# Altium project FE.PrjPcb
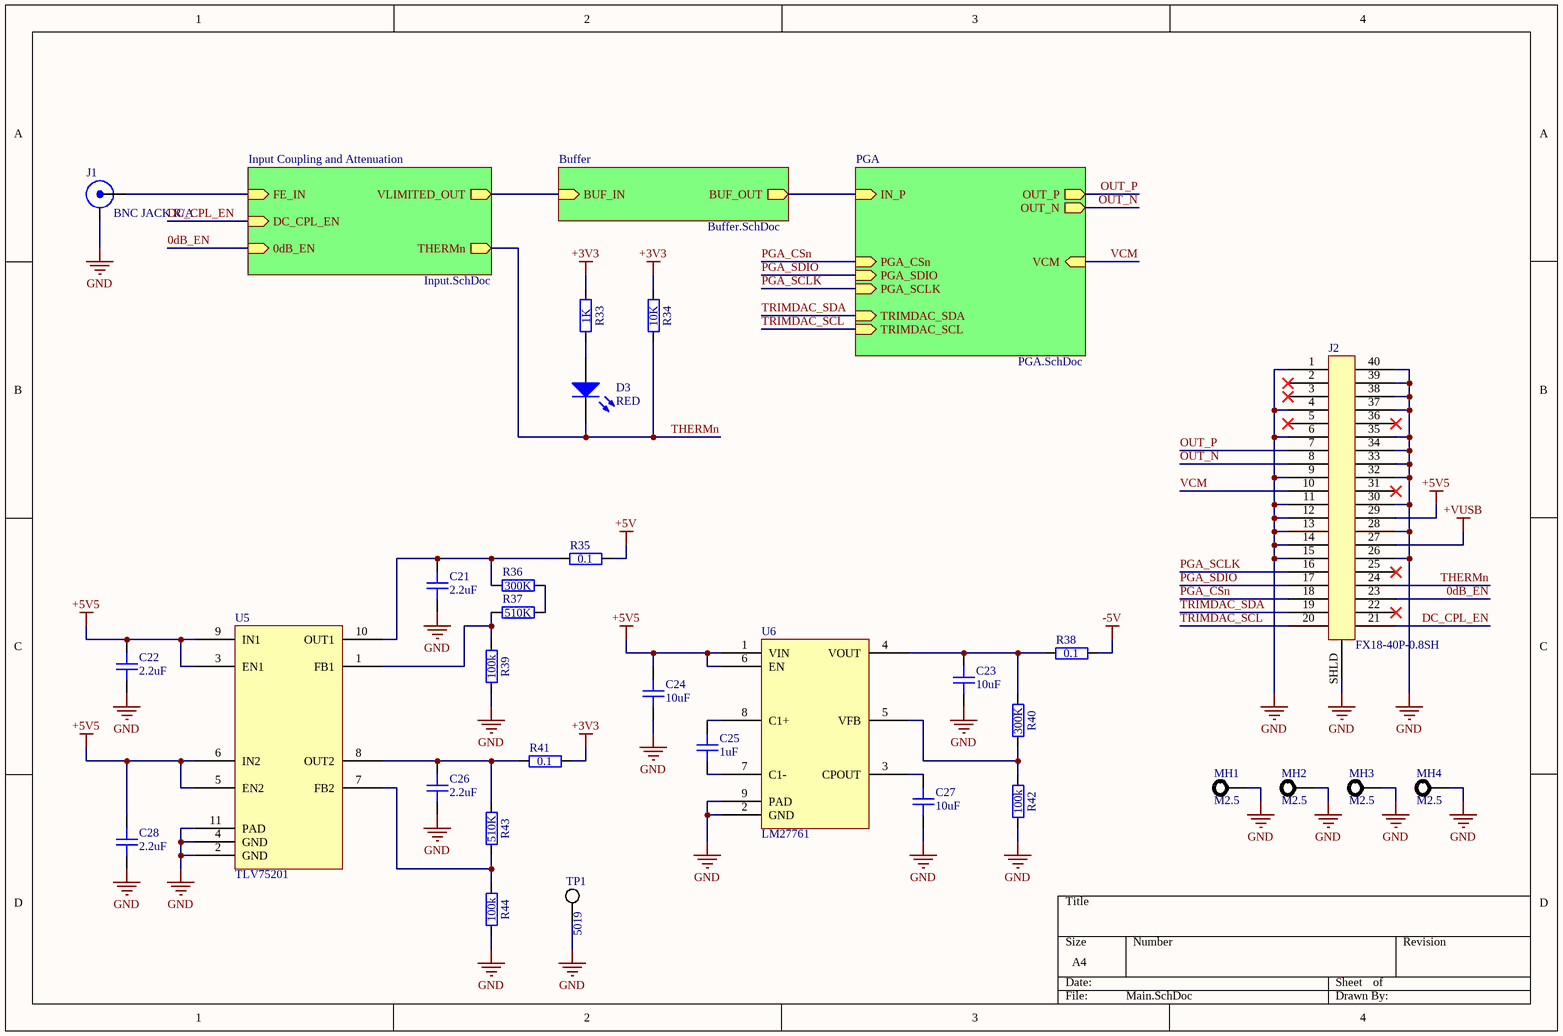
[diagram p0: Main.SchDoc]
4 sheets, 122 parts. Net scope: hierarchical (ports join the sheet entries above them; power ports are global).
Board file: FE.PcbDoc
Sheets:
  Main.SchDoc
    Input Coupling and Attenuation = Input.SchDoc
    Buffer = Buffer.SchDoc
    PGA = PGA.SchDoc

## Sheet Main.SchDoc
size A4

### Parts
C21  value 2.2uF  [GEN_C_0402]  (hidden comment: CAP 2.2uF 10V X5R 0402)
C22  value 2.2uF  [GEN_C_0402]  (hidden comment: CAP 2.2uF 10V X5R 0402)
C23  value 10uF  [GEN_C_0603]  (hidden comment: CAP 10uF 10V X5R 0603)
C24  value 10uF  [GEN_C_0603]  (hidden comment: CAP 10uF 10V X5R 0603)
C25  value 1uF  [GEN_C_0402]  (hidden comment: CAP 1uF 25V X5R 0402)
C26  value 2.2uF  [GEN_C_0402]  (hidden comment: CAP 2.2uF 10V X5R 0402)
C27  value 10uF  [GEN_C_0603]  (hidden comment: CAP 10uF 10V X5R 0603)
C28  value 2.2uF  [GEN_C_0402]  (hidden comment: CAP 2.2uF 10V X5R 0402)
D3  RED  [LED_0603_APT1608]
J1  BNC JACK R/A  [MOL_0731000105]
J2  FX18-40P-0.8SH  [HIR_FX18-40P-0.8SH]
MH1  M2.5  [MH M2.5]  (no BOM)
MH2  M2.5  [MH M2.5]  (no BOM)
MH3  M2.5  [MH M2.5]  (no BOM)
MH4  M2.5  [MH M2.5]  (no BOM)
R33  value 1K  [GEN_R_0402]  (hidden comment: RES 1K OHM 1% 1/10W 0402)
R34  value 10K  [GEN_R_0402]  (hidden comment: RES 10K OHM 1% 1/10W 0402)
R35  0.1  [GEN_R_0402]
R36  value 300K  [GEN_R_0402]  (hidden comment: RES 300K OHM 1% 1/10W 0402)
R37  value 510K  [GEN_R_0402]  (hidden comment: RES 510K OHM 1% 1/10W 0402)
R38  0.1  [GEN_R_0402]
R39  value 100k  [GEN_R_0402]  (hidden comment: RES 100K OHM 1% 1/10W 0402)
R40  value 300K  [GEN_R_0402]  (hidden comment: RES 300K OHM 1% 1/10W 0402)
R41  0.1  [GEN_R_0402]
R42  value 100k  [GEN_R_0402]  (hidden comment: RES 100K OHM 1% 1/10W 0402)
R43  value 510K  [GEN_R_0402]  (hidden comment: RES 510K OHM 1% 1/10W 0402)
R44  value 100k  [GEN_R_0402]  (hidden comment: RES 100K OHM 1% 1/10W 0402)
TP1  5019  [KEY_5019]
U5  TLV75201  [TI_WSON10_DSQ0010A]
U6  LM27761  [TI_WSON8_DSG0008A]

### Sub-sheets
Buffer = Buffer.SchDoc: BUF_IN (in), BUF_OUT (out)
Input Coupling and Attenuation = Input.SchDoc: 0dB_EN (in), FE_IN (in), VLIMITED_OUT (out), DC_CPL_EN (in), THERMn (out)
PGA = PGA.SchDoc: IN_P (in), OUT_N (out), PGA_SDIO (in), OUT_P (out), VCM (in), PGA_SCLK (in), PGA_CSn (in), TRIMDAC_SDA (in), TRIMDAC_SCL (in)

### Nets
+3V3: R33.1 R34.2 R41.2
+5V: R35.2
+5V5: C22.2 C24.2 C28.2 J2.29 U5.3(EN1) U5.5(EN2) U5.6(IN2) U5.9(IN1) U6.1(VIN) U6.6(EN)
+VUSB: J2.27
-5V: R38.2
GND: C21.1 C22.1 C23.1 C24.1 C26.1 C27.1 C28.1 J1.2(SHIELD) J2.1 J2.4 J2.6 J2.9 J2.11 J2.12 J2.13 J2.14 J2.15 J2.26 J2.28 J2.30 J2.32 J2.33 J2.34 J2.35 J2.37 J2.38 J2.39 J2.40 J2.SHLD MH1.1 MH2.1 MH3.1 MH4.1 R39.1 R42.1 R44.1 TP1.1 U5.2(GND) U5.4(GND) U5.11(PAD) U6.2(GND) U6.9(PAD)
0dB_EN: J2.23 ; sheet Input Coupling and Attenuation/0dB_EN
DC_CPL_EN: J2.21 ; sheet Input Coupling and Attenuation/DC_CPL_EN
OUT_N: J2.8 ; sheet PGA/OUT_N
OUT_P: J2.7 ; sheet PGA/OUT_P
PGA_CSn: J2.18 ; sheet PGA/PGA_CSn
PGA_SCLK: J2.16 ; sheet PGA/PGA_SCLK
PGA_SDIO: J2.17 ; sheet PGA/PGA_SDIO
THERMn: D3.1(K) J2.24 R34.1 ; sheet Input Coupling and Attenuation/THERMn
TRIMDAC_SCL: J2.20 ; sheet PGA/TRIMDAC_SCL
TRIMDAC_SDA: J2.19 ; sheet PGA/TRIMDAC_SDA
VCM: J2.10 ; sheet PGA/VCM
NetC1_2: sheet Input Coupling and Attenuation/VLIMITED_OUT, sheet Buffer/BUF_IN
NetC14_2: J1.1(Signal) ; sheet Input Coupling and Attenuation/FE_IN
NetC21_2: C21.2 R35.1 R36.2 U5.10(OUT1)
NetC23_2: C23.2 R38.1 R40.2 U6.4(VOUT)
NetC25_1: C25.1 U6.7(C1-)
NetC25_2: C25.2 U6.8(C1+)
NetC26_2: C26.2 R41.1 R43.2 U5.8(OUT2)
NetC27_2: C27.2 U6.3(CPOUT)
NetD3_2: D3.2(A) R33.2
NetQ1_2: sheet Buffer/BUF_OUT, sheet PGA/IN_P
NetR36_1: R36.1 R37.1
NetR37_2: R37.2 R39.2 U5.1(FB1)
NetR40_1: R40.1 R42.2 U6.5(VFB)
NetR43_1: R43.1 R44.2 U5.7(FB2)

Not connected (* = marked no-connect by the designer): J2 2* 3* 5* 22* 25* 31* 36*

### Library data of the parts
D3 = LED RED 0603 APT1608: Supplier 1: Digi-Key; Supplier Part Number 1: 754-1930-1-ND
J2 = CONN HDR FX18-40P-0.8SH: Supplier 1: Digi-Key; Supplier Part Number 1: H11868-ND
MH1-MH4 = MH M2.5
R33 = RES 1K OHM 1% 1/10W 0402: Power Rating: 0.1W; Tolerance: 1%; Package: 0402; Supplier 1: Digi-Key; Supplier Part Number 1: P1.00KLCT-ND
R34 = RES 10K OHM 1% 1/10W 0402: Power Rating: 0.1W; Tolerance: 1%; Package: 0402; Supplier 1: Digi-Key; Supplier Part Number 1: P10.0KLCT-ND
R35 R38 R41 = RES 0.1 OHM 1% 1/6W 0402: Tolerance: 1%; Power Rating: 0.16W; Package: 0402; Supplier 1: Digi-Key; Supplier Part Number 1: P.10AKCT-ND; Value: 0.1
R36 R40 = RES 300K OHM 1% 1/10W 0402: Power Rating: 0.1W; Tolerance: 1%; Package: 0402; Supplier 1: Digi-Key; Supplier Part Number 1: P300KLCT-ND
R37 R43 = RES 510K OHM 1% 1/10W 0402: Power Rating: 0.1W; Tolerance: 1%; Package: 0402; Supplier 1: Digi-Key; Supplier Part Number 1: P510KLCT-ND
R39 R42 R44 = RES 100K OHM 1% 1/10W 0402: Power Rating: 0.1W; Tolerance: 1%; Package: 0402; Supplier 1: Digi-Key; Supplier Part Number 1: P100KLCT-ND
TP1 = TP KEYSTONE 5019: Supplier 1: Digi-Key; Supplier Part Number 1: 36-5019CT-ND
U5 = IC LDO TLV75201: Supplier 1: Digi-Key; Supplier Part Number 1: 296-TLV75201PDSQRCT-ND
U6 = IC CPUMP LM27761: Supplier 1: Digi-Key; Supplier Part Number 1: 296-44379-1-ND
C21 C22 C26 C28 = CAP 2.2uF 10V X5R 0402: Package: 0402; Voltage Rating: 10V; Supplier 1: Digi-Key; Supplier Part Number 1: 587-3153-1-ND
C23 C24 C27 = CAP 10uF 10V X5R 0603: Package: 0402; Voltage Rating: 10V; Supplier 1: Digi-Key; Supplier Part Number 1: 490-10474-1-ND
C25 = CAP 1uF 25V X5R 0402: Package: 0402; Voltage Rating: 25V; Supplier 1: Digi-Key; Supplier Part Number 1: 490-10017-1-ND
J1 = BNC JACK R/A: Supplier 1: Digi-Key; Supplier Part Number 1: WM5524-ND

## Sheet Input.SchDoc
size A4
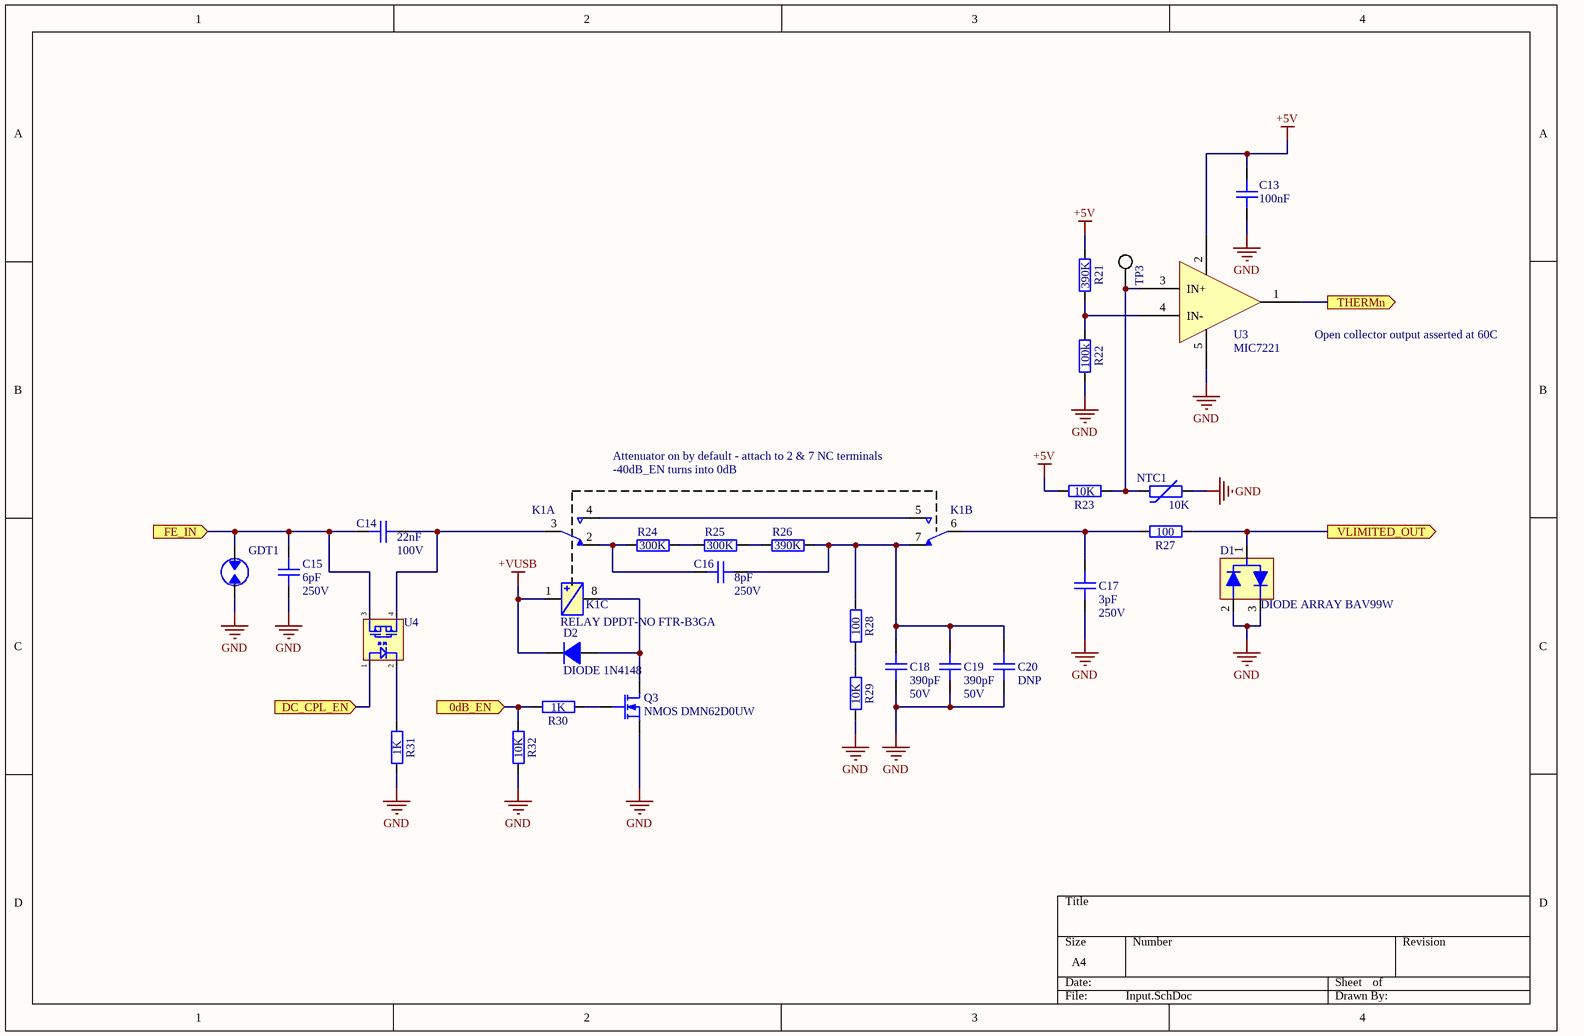
[diagram p1: Input.SchDoc]

### Parts
C13  value 100nF  [GEN_C_0402]  (hidden comment: CAP 100nF 16V X7R 0402)
C14  value 22nF  Voltage Rating: 100V  [GEN_C_0603]  (hidden comment: CAP 22nF 100V X7R 0603)
C15  value 6pF  Voltage Rating: 250V  [GEN_C_0603]  (hidden comment: CAP 6pF 250V C0G 0603)
C16  value 8pF  Voltage Rating: 250V  [GEN_C_0603]  (hidden comment: CAP 8pF 250V C0G 0603)
C17  value 3pF  Voltage Rating: 250V  [GEN_C_0603]  (hidden comment: CAP 3pF 250V C0G 0603)
C18  value 390pF  Voltage Rating: 50V  [GEN_C_0402]  (hidden comment: CAP 390pF 50V C0G 0402)
C19  value 390pF  Voltage Rating: 50V  [GEN_C_0402]  (hidden comment: CAP 390pF 50V C0G 0402)
C20  value DNP  [GEN_C_0402]  (hidden comment: CAP DNP 0402)
D1  DIODE ARRAY BAV99W  [GEN_SOT_323]
D2  DIODE 1N4148  [GEN_SOD_323]
GDT1  GDT 90V  [BOU_2051]  (value not drawn)
K1  RELAY DPDT-NO FTR-B3GA  [FUJ_FTR-B3GA]  (value not drawn)  (parts A,B,C of 3)
NTC1  value 10K  [GEN_R_0402]  (hidden comment: NTC 10K 3900K 0402)
Q3  NMOS DMN62D0UW  [GEN_SOT_323]
R21  value 390K  [GEN_R_0402]  (hidden comment: RES 390K OHM 1% 1/10W 0402)
R22  value 100k  [GEN_R_0402]  (hidden comment: RES 100K OHM 1% 1/10W 0402)
R23  value 10K  [GEN_R_0402]  (hidden comment: RES 10K OHM 1% 1/10W 0402)
R24  value 300K  [GEN_R_0402]  (hidden comment: RES 300K OHM 1% 1/10W 0402)
R25  value 300K  [GEN_R_0402]  (hidden comment: RES 300K OHM 1% 1/10W 0402)
R26  value 390K  [GEN_R_0402]  (hidden comment: RES 390K OHM 1% 1/10W 0402)
R27  value 100  [GEN_R_0402]  (hidden comment: RES 100 OHM 1% 1/10W 0402)
R28  value 100  [GEN_R_0402]  (hidden comment: RES 100 OHM 1% 1/10W 0402)
R29  value 10K  [GEN_R_0402]  (hidden comment: RES 10K OHM 1% 1/10W 0402)
R30  value 1K  [GEN_R_0402]  (hidden comment: RES 1K OHM 1% 1/10W 0402)
R31  value 1K  [GEN_R_0402]  (hidden comment: RES 1K OHM 1% 1/10W 0402)
R32  value 10K  [GEN_R_0402]  (hidden comment: RES 10K OHM 1% 1/10W 0402)
TP3  5019  [KEY_5019]  (value not drawn)
U3  MIC7221  [GEN_SOT23_5_950_2900X1600X1450]
U4  SSR CPC1017NTR  [IXY_CPC1017]  (value not drawn)

### Ports
0dB_EN (in), DC_CPL_EN (in), FE_IN (in), THERMn (out), VLIMITED_OUT (out)

### Nets
+5V: C13.1 R21.1 R23.2 U3.2(V+)
+VUSB: D2.1(K) K1.1
GND: C13.2 C15.1 C17.2 C18.1 C19.1 C20.1 D1.2 D1.3 GDT1.2 NTC1.2 Q3.3(S) R22.2 R29.1 R31.1 R32.1 U3.5(V-)
0dB_EN: R30.2 R32.2 ; port 0dB_EN
DC_CPL_EN: U4.1 ; port DC_CPL_EN
THERMn: U3.1(OUT) ; port THERMn
NetC1_2: D1.1 R27.1 ; port VLIMITED_OUT
NetC14_1: C14.1 K1.3 U4.4
NetC14_2: C14.2 C15.2 GDT1.1 U4.3 ; port FE_IN
NetC16_1: C16.1 C18.2 C19.2 C20.2 K1.7 R26.2 R28.2
NetC16_2: C16.2 K1.2 R24.1
NetC17_1: C17.1 K1.6 R27.2
NetD2_2: D2.2(A) K1.8 Q3.1(D)
NetK1_4: K1.4 K1.5
NetNTC1_1: NTC1.1 R23.1 TP3.1 U3.3(IN+)
NetQ3_2: Q3.2(G) R30.1
NetR21_2: R21.2 R22.1 U3.4(IN-)
NetR24_2: R24.2 R25.1
NetR25_2: R25.2 R26.1
NetR28_1: R28.1 R29.2
NetR31_2: R31.2 U4.2

### Notes on the sheet
- Open collector output asserted at 60C
- Attenuator on by default - attach to 2 & 7 NC terminals
- -40dB_EN turns into 0dB

### Library data of the parts
D2 = DIODE 1N4148: Max Reverse Voltage: 75V; Max Current: 150mA; Supplier 1: Digi-Key; Supplier Part Number 1: 1N4148WS-FDICT-ND
Q3 = NMOS DMN62D0UW: Vdss: 60V; Id: 340mA; Max Power: 320mW; Supplier 1: Digi-Key; Supplier Part Number 1: DMN62D0UW-7DICT-ND
R21 R26 = RES 390K OHM 1% 1/10W 0402: Power Rating: 0.1W; Tolerance: 1%; Package: 0402; Supplier 1: Digi-Key; Supplier Part Number 1: P390KLCT-ND
R22 = RES 100K OHM 1% 1/10W 0402: Power Rating: 0.1W; Tolerance: 1%; Package: 0402; Supplier 1: Digi-Key; Supplier Part Number 1: P100KLCT-ND
R23 R29 R32 = RES 10K OHM 1% 1/10W 0402: Power Rating: 0.1W; Tolerance: 1%; Package: 0402; Supplier 1: Digi-Key; Supplier Part Number 1: P10.0KLCT-ND
R24 R25 = RES 300K OHM 1% 1/10W 0402: Power Rating: 0.1W; Tolerance: 1%; Package: 0402; Supplier 1: Digi-Key; Supplier Part Number 1: P300KLCT-ND
R27 R28 = RES 100 OHM 1% 1/10W 0402: Power Rating: 0.1W; Tolerance: 1%; Package: 0402; Supplier 1: Digi-Key; Supplier Part Number 1: P100LCT-ND
R30 R31 = RES 1K OHM 1% 1/10W 0402: Power Rating: 0.1W; Tolerance: 1%; Package: 0402; Supplier 1: Digi-Key; Supplier Part Number 1: P1.00KLCT-ND
TP3 = TP KEYSTONE 5019: Supplier 1: Digi-Key; Supplier Part Number 1: 36-5019CT-ND
U3 = IC COMP MIC7221YM5: Supplier 1: Digi-Key; Supplier Part Number 1: 576-2901-1-ND
C13 = CAP 100nF 16V X7R 0402: Package: 0402; Voltage Rating: 16V; Supplier 1: Digi-Key; Supplier Part Number 1: 490-4759-1-ND
C14 = CAP 22nF 100V X7R 0603: Package: 0603; Supplier 1: Digi-Key; Supplier Part Number 1: 490-4782-1-ND
C15 = CAP 6pF 250V C0G 0603: Supplier 1: Digi-Key; Supplier Part Number 1: 399-8734-1-ND; Package: 0603
C16 = CAP 8pF 250V C0G 0603: Package: 0603; Supplier 1: Digi-Key; Supplier Part Number 1: 399-8740-1-ND
C17 = CAP 3pF 250V C0G 0603: Package: 0603; Supplier 1: Digi-Key; Supplier Part Number 1: 399-8820-1-ND
C18 C19 = CAP 390pF 50V C0G 0402: Package: 0402; Supplier 1: Digi-Key; Supplier Part Number 1: 490-8202-1-ND
C20 = CAP DNP 0402: Package: 0402
D1 = DIODE ARRAY BAV99W: Supplier 1: Digi-Key; Supplier Part Number 1: BAV99W-FDICT-ND
GDT1 = GDT 90V: Supplier 1: Digi-Key; Supplier Part Number 1: 2051-09-SM-RPLFCT-ND
NTC1 = NTC 10K 3900K 0402: Package: 0402; B Value: 3900k; Supplier 1: Digi-Key; Supplier Part Number 1: P12985CT-ND
U4 = SSR CPC1017NTR: Supplier 1: Digi-Key; Supplier Part Number 1: CLA233CT-ND

## Sheet Buffer.SchDoc
size A4
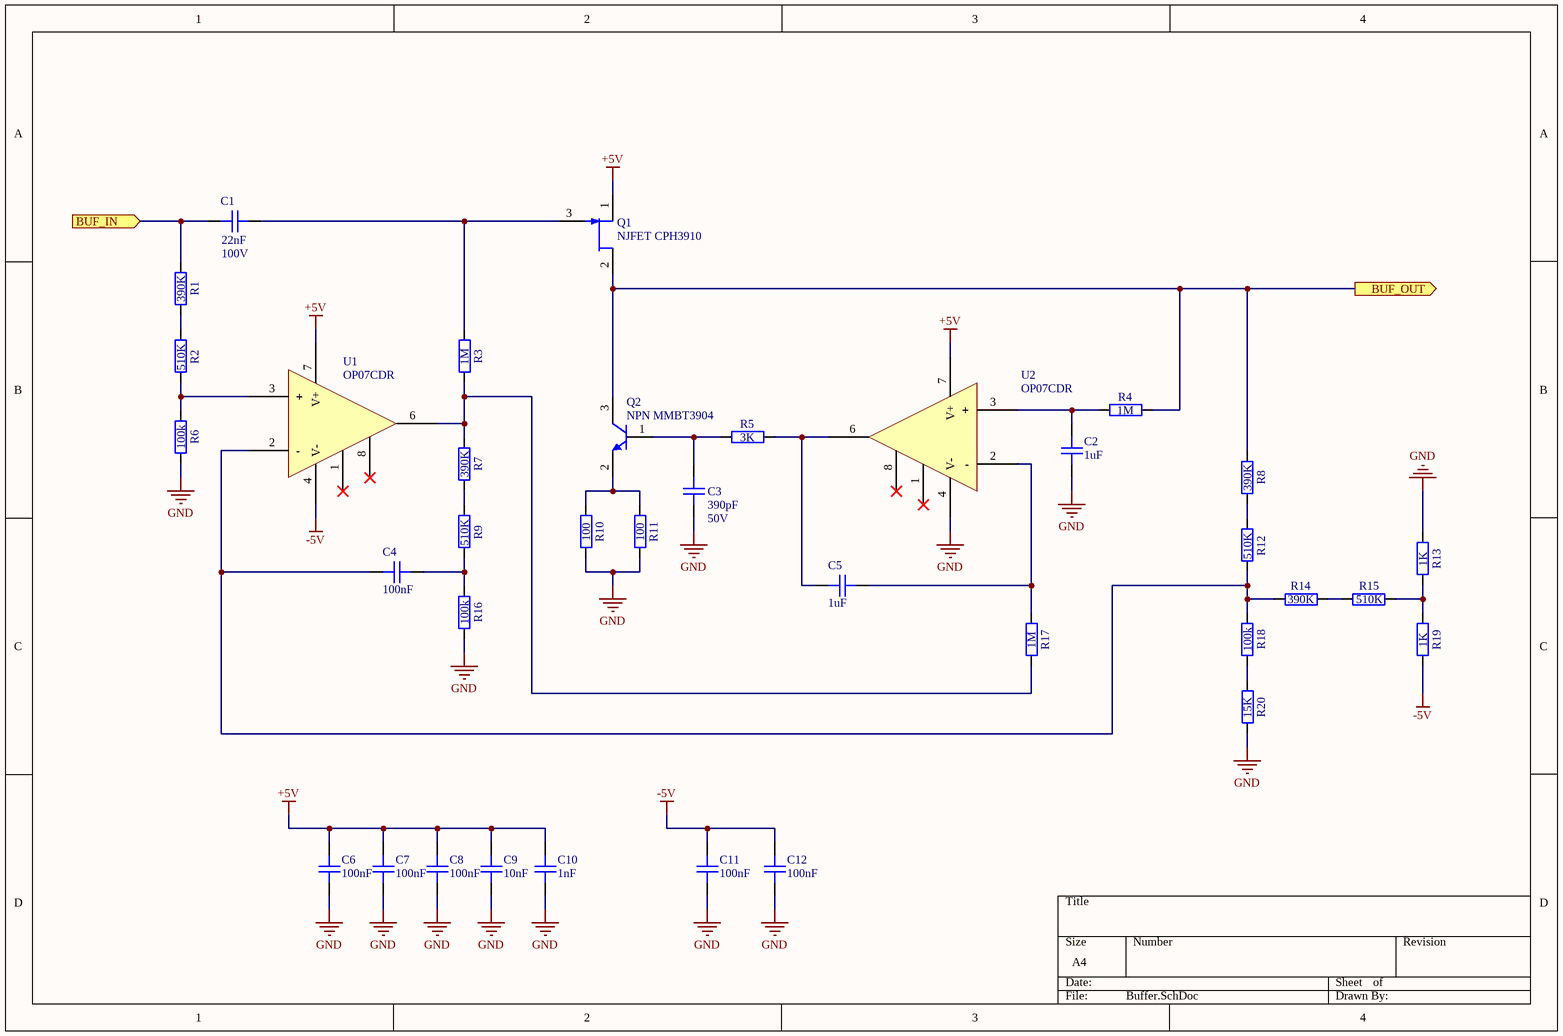
[diagram p2: Buffer.SchDoc]

### Parts
C1  value 22nF  Voltage Rating: 100V  [GEN_C_0603]  (hidden comment: CAP 22nF 100V X7R 0603)
C2  value 1uF  [GEN_C_0402]  (hidden comment: CAP 1uF 25V X5R 0402)
C3  value 390pF  Voltage Rating: 50V  [GEN_C_0402]  (hidden comment: CAP 390pF 50V C0G 0402)
C4  value 100nF  [GEN_C_0402]  (hidden comment: CAP 100nF 16V X7R 0402)
C5  value 1uF  [GEN_C_0402]  (hidden comment: CAP 1uF 25V X5R 0402)
C6  value 100nF  [GEN_C_0402]  (hidden comment: CAP 100nF 16V X7R 0402)
C7  value 100nF  [GEN_C_0402]  (hidden comment: CAP 100nF 16V X7R 0402)
C8  value 100nF  [GEN_C_0402]  (hidden comment: CAP 100nF 16V X7R 0402)
C9  value 10nF  [GEN_C_0402]  (hidden comment: CAP 10nF 50V X7R 0402)
C10  value 1nF  [GEN_C_0402]  (hidden comment: CAP 1nF 50V X7R 0402)
C11  value 100nF  [GEN_C_0402]  (hidden comment: CAP 100nF 16V X7R 0402)
C12  value 100nF  [GEN_C_0402]  (hidden comment: CAP 100nF 16V X7R 0402)
Q1  NJFET CPH3910  [ON_SOT23_CPH3]
Q2  NPN MMBT3904  [MMC_SOT23]
R1  value 390K  [GEN_R_0402]  (hidden comment: RES 390K OHM 1% 1/10W 0402)
R2  value 510K  [GEN_R_0402]  (hidden comment: RES 510K OHM 1% 1/10W 0402)
R3  value 1M  [GEN_R_0402]  (hidden comment: RES 1M OHM 1% 1/10W 0402)
R4  value 1M  [GEN_R_0402]  (hidden comment: RES 1M OHM 1% 1/10W 0402)
R5  value 3K  [GEN_R_0402]  (hidden comment: RES 3K OHM 1% 1/10W 0402)
R6  value 100k  [GEN_R_0402]  (hidden comment: RES 100K OHM 1% 1/10W 0402)
R7  value 390K  [GEN_R_0402]  (hidden comment: RES 390K OHM 1% 1/10W 0402)
R8  value 390K  [GEN_R_0402]  (hidden comment: RES 390K OHM 1% 1/10W 0402)
R9  value 510K  [GEN_R_0402]  (hidden comment: RES 510K OHM 1% 1/10W 0402)
R10  value 100  [GEN_R_0402]  (hidden comment: RES 100 OHM 1% 1/10W 0402)
R11  value 100  [GEN_R_0402]  (hidden comment: RES 100 OHM 1% 1/10W 0402)
R12  value 510K  [GEN_R_0402]  (hidden comment: RES 510K OHM 1% 1/10W 0402)
R13  value 1K  [GEN_R_0402]  (hidden comment: RES 1K OHM 1% 1/10W 0402)
R14  value 390K  [GEN_R_0402]  (hidden comment: RES 390K OHM 1% 1/10W 0402)
R15  value 510K  [GEN_R_0402]  (hidden comment: RES 510K OHM 1% 1/10W 0402)
R16  value 100k  [GEN_R_0402]  (hidden comment: RES 100K OHM 1% 1/10W 0402)
R17  value 1M  [GEN_R_0402]  (hidden comment: RES 1M OHM 1% 1/10W 0402)
R18  value 100k  [GEN_R_0402]  (hidden comment: RES 100K OHM 1% 1/10W 0402)
R19  value 1K  [GEN_R_0402]  (hidden comment: RES 1K OHM 1% 1/10W 0402)
R20  value 15K  [GEN_R_0402]  (hidden comment: RES 15K OHM 1% 1/10W 0402)
U1  OP07CDR  [TI_SOIC8_D0008A]
U2  OP07CDR  [TI_SOIC8_D0008A]

### Ports
BUF_IN (in), BUF_OUT (out)

### Nets
+5V: C6.1 C7.1 C8.1 C9.2 C10.2 Q1.1(S) U1.7(V+) U2.7(V+)
-5V: C11.1 C12.1 R19.2 U1.4(V-)
GND: C2.1 C3.1 C6.2 C7.2 C8.2 C9.1 C10.1 C11.2 C12.2 R6.2 R10.1 R11.1 R13.1 R16.2 R20.1 U2.4(V-)
NetC1_1: C1.1 Q1.3(G) R3.2
NetC1_2: C1.2 R1.1 ; port BUF_IN
NetC2_2: C2.2 R4.2 U2.3(+)
NetC3_2: C3.2 Q2.1(B) R5.2
NetC4_1: C4.1 R9.2 R16.1
NetC4_2: C4.2 R12.2 R14.1 R18.1 U1.2(-)
NetC5_1: C5.1 R17.2 U2.2(-)
NetC5_2: C5.2 R5.1 U2.6(OUT)
NetQ1_2: Q1.2(D) Q2.3(C) R4.1 R8.1 ; port BUF_OUT
NetQ2_2: Q2.2(E) R10.2 R11.2
NetR1_2: R1.2 R2.1
NetR2_2: R2.2 R6.1 U1.3(+)
NetR3_1: R3.1 R7.1 R17.1 U1.6(OUT)
NetR7_2: R7.2 R9.1
NetR8_2: R8.2 R12.1
NetR13_2: R13.2 R15.2 R19.1
NetR14_2: R14.2 R15.1
NetR18_2: R18.2 R20.2

Not connected (* = marked no-connect by the designer): U1 1(N1)* 8(N2)*; U2 1(N1)* 8(N2)*

### Library data of the parts
R1 R7 R8 R14 = RES 390K OHM 1% 1/10W 0402: Power Rating: 0.1W; Tolerance: 1%; Package: 0402; Supplier 1: Digi-Key; Supplier Part Number 1: P390KLCT-ND
R2 R9 R12 R15 = RES 510K OHM 1% 1/10W 0402: Power Rating: 0.1W; Tolerance: 1%; Package: 0402; Supplier 1: Digi-Key; Supplier Part Number 1: P510KLCT-ND
R3 R4 R17 = RES 1M OHM 1% 1/10W 0402: Power Rating: 0.1W; Tolerance: 1%; Package: 0402; Supplier 1: Digi-Key; Supplier Part Number 1: P1.00MLCT-ND
R5 = RES 3K OHM 1% 1/10W 0402: Power Rating: 0.1W; Tolerance: 1%; Package: 0402; Supplier 1: Digi-Key; Supplier Part Number 1: P3.00KLCT-ND
R6 R16 R18 = RES 100K OHM 1% 1/10W 0402: Power Rating: 0.1W; Tolerance: 1%; Package: 0402; Supplier 1: Digi-Key; Supplier Part Number 1: P100KLCT-ND
R10 R11 = RES 100 OHM 1% 1/10W 0402: Power Rating: 0.1W; Tolerance: 1%; Package: 0402; Supplier 1: Digi-Key; Supplier Part Number 1: P100LCT-ND
R13 R19 = RES 1K OHM 1% 1/10W 0402: Power Rating: 0.1W; Tolerance: 1%; Package: 0402; Supplier 1: Digi-Key; Supplier Part Number 1: P1.00KLCT-ND
R20 = RES 15K OHM 1% 1/10W 0402: Power Rating: 0.1W; Tolerance: 1%; Package: 0402; Supplier 1: Digi-Key; Supplier Part Number 1: P15.0KLCT-ND
U1 U2 = IC OPAMP OP07CDR: Supplier 1: Digi-Key; Supplier Part Number 1: 296-14626-1-ND
C1 = CAP 22nF 100V X7R 0603: Package: 0603; Supplier 1: Digi-Key; Supplier Part Number 1: 490-4782-1-ND
C2 C5 = CAP 1uF 25V X5R 0402: Package: 0402; Voltage Rating: 25V; Supplier 1: Digi-Key; Supplier Part Number 1: 490-10017-1-ND
C3 = CAP 390pF 50V C0G 0402: Package: 0402; Supplier 1: Digi-Key; Supplier Part Number 1: 490-8202-1-ND
C4 C6-C8 C11 C12 = CAP 100nF 16V X7R 0402: Package: 0402; Voltage Rating: 16V; Supplier 1: Digi-Key; Supplier Part Number 1: 490-4759-1-ND
C9 = CAP 10nF 50V X7R 0402: Package: 0402; Voltage Rating: 50V; Supplier 1: Digi-Key; Supplier Part Number 1: 490-4762-1-ND
C10 = CAP 1nF 50V X7R 0402: Package: 0402; Voltage Rating: 50V; Supplier 1: Digi-Key; Supplier Part Number 1: 490-4761-1-ND
Q1 = NJFET CPH3910: Supplier 1: Digi-Key; Supplier Part Number 1: CPH3910-TL-EOSCT-ND
Q2 = NPN MMBT3904: Supplier 1: Digi-Key; Supplier Part Number 1: MMBT3904TPMSCT-ND

## Sheet PGA.SchDoc
size A4
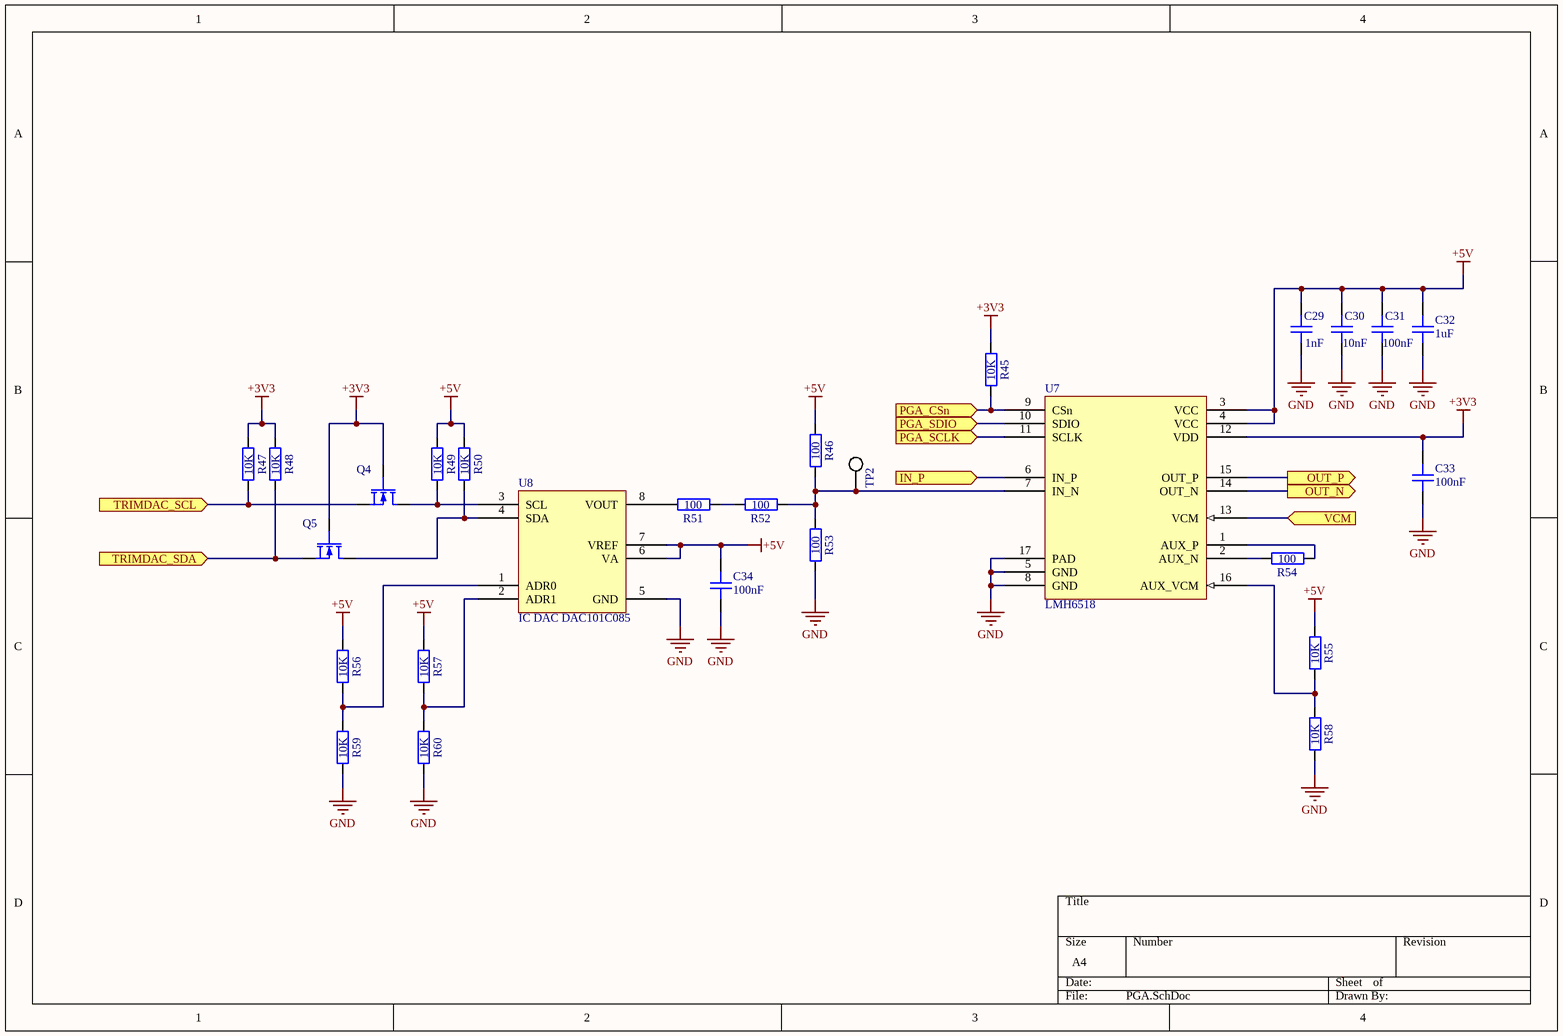
[diagram p3: PGA.SchDoc]

### Parts
C29  value 1nF  [GEN_C_0402]  (hidden comment: CAP 1nF 50V X7R 0402)
C30  value 10nF  [GEN_C_0402]  (hidden comment: CAP 10nF 50V X7R 0402)
C31  value 100nF  [GEN_C_0402]  (hidden comment: CAP 100nF 16V X7R 0402)
C32  value 1uF  [GEN_C_0402]  (hidden comment: CAP 1uF 25V X5R 0402)
C33  value 100nF  [GEN_C_0402]  (hidden comment: CAP 100nF 16V X7R 0402)
C34  value 100nF  [GEN_C_0402]  (hidden comment: CAP 100nF 16V X7R 0402)
Q4  NMOS DMN62D0UW  [GEN_SOT_323]  (value not drawn)
Q5  NMOS DMN62D0UW  [GEN_SOT_323]  (value not drawn)
R45  value 10K  [GEN_R_0402]  (hidden comment: RES 10K OHM 1% 1/10W 0402)
R46  value 100  [GEN_R_0402]  (hidden comment: RES 100 OHM 1% 1/10W 0402)
R47  value 10K  [GEN_R_0402]  (hidden comment: RES 10K OHM 1% 1/10W 0402)
R48  value 10K  [GEN_R_0402]  (hidden comment: RES 10K OHM 1% 1/10W 0402)
R49  value 10K  [GEN_R_0402]  (hidden comment: RES 10K OHM 1% 1/10W 0402)
R50  value 10K  [GEN_R_0402]  (hidden comment: RES 10K OHM 1% 1/10W 0402)
R51  value 100  [GEN_R_0402]  (hidden comment: RES 100 OHM 1% 1/10W 0402)
R52  value 100  [GEN_R_0402]  (hidden comment: RES 100 OHM 1% 1/10W 0402)
R53  value 100  [GEN_R_0402]  (hidden comment: RES 100 OHM 1% 1/10W 0402)
R54  value 100  [GEN_R_0402]  (hidden comment: RES 100 OHM 1% 1/10W 0402)
R55  value 10K  [GEN_R_0402]  (hidden comment: RES 10K OHM 1% 1/10W 0402)
R56  value 10K  [GEN_R_0402]  (hidden comment: RES 10K OHM 1% 1/10W 0402)
R57  value 10K  [GEN_R_0402]  (hidden comment: RES 10K OHM 1% 1/10W 0402)
R58  value 10K  [GEN_R_0402]  (hidden comment: RES 10K OHM 1% 1/10W 0402)
R59  value 10K  [GEN_R_0402]  (hidden comment: RES 10K OHM 1% 1/10W 0402)
R60  value 10K  [GEN_R_0402]  (hidden comment: RES 10K OHM 1% 1/10W 0402)
TP2  5019  [KEY_5019]  (value not drawn)
U7  LMH6518  [TI_WQFN_RGH0016A]
U8  IC DAC DAC101C085  [TI_VSSOP8_DGK]

### Ports
IN_P (in), OUT_N (out), OUT_P (out), PGA_CSn (in), PGA_SCLK (in), PGA_SDIO (in), TRIMDAC_SCL (in), TRIMDAC_SDA (in), VCM (in)

### Nets
+3V3: C33.2 Q4.2(G) Q5.2(G) R45.2 R47.2 R48.2 U7.12(VDD)
+5V: C29.2 C30.2 C31.2 C32.2 C34.2 R46.2 R49.2 R50.2 R55.2 R56.2 R57.2 U7.3(VCC) U7.4(VCC) U8.6(VA) U8.7(VREF)
GND: C29.1 C30.1 C31.1 C32.1 C33.1 C34.1 R53.1 R58.1 R59.1 R60.1 U7.5(GND) U7.8(GND) U7.17(PAD) U8.5(GND)
OUT_N: U7.14(OUT_N) ; port OUT_N
OUT_P: U7.15(OUT_P) ; port OUT_P
PGA_CSn: R45.1 U7.9(CSn) ; port PGA_CSn
PGA_SCLK: U7.11(SCLK) ; port PGA_SCLK
PGA_SDIO: U7.10(SDIO) ; port PGA_SDIO
TRIMDAC_SCL: Q4.3(S) R47.1 ; port TRIMDAC_SCL
TRIMDAC_SDA: Q5.3(S) R48.1 ; port TRIMDAC_SDA
VCM: U7.13(VCM) ; port VCM
NetQ1_2: U7.6(IN_P) ; port IN_P
NetQ4_1: Q4.1(D) R49.1 U8.3(SCL)
NetQ5_1: Q5.1(D) R50.1 U8.4(SDA)
NetR46_1: R46.1 R52.1 R53.2 TP2.1 U7.7(IN_N)
NetR51_1: R51.1 R52.2
NetR51_2: R51.2 U8.8(VOUT)
NetR54_1: R54.1 U7.1(AUX_P)
NetR54_2: R54.2 U7.2(AUX_N)
NetR55_1: R55.1 R58.2 U7.16(AUX_VCM)
NetR56_1: R56.1 R59.2 U8.1(ADR0)
NetR57_1: R57.1 R60.2 U8.2(ADR1)

### Library data of the parts
Q4 Q5 = NMOS DMN62D0UW: Vdss: 60V; Id: 340mA; Max Power: 320mW; Supplier 1: Digi-Key; Supplier Part Number 1: DMN62D0UW-7DICT-ND
R45 R47-R50 R55-R60 = RES 10K OHM 1% 1/10W 0402: Power Rating: 0.1W; Tolerance: 1%; Package: 0402; Supplier 1: Digi-Key; Supplier Part Number 1: P10.0KLCT-ND
R46 R51-R54 = RES 100 OHM 1% 1/10W 0402: Power Rating: 0.1W; Tolerance: 1%; Package: 0402; Supplier 1: Digi-Key; Supplier Part Number 1: P100LCT-ND
TP2 = TP KEYSTONE 5019: Supplier 1: Digi-Key; Supplier Part Number 1: 36-5019CT-ND
U7 = IC PGA LMH6518: Supplier 1: Digi-Key; Supplier Part Number 1: LMH6518SQE/NOPBCT-ND
C29 = CAP 1nF 50V X7R 0402: Package: 0402; Voltage Rating: 50V; Supplier 1: Digi-Key; Supplier Part Number 1: 490-4761-1-ND
C30 = CAP 10nF 50V X7R 0402: Package: 0402; Voltage Rating: 50V; Supplier 1: Digi-Key; Supplier Part Number 1: 490-4762-1-ND
C31 C33 C34 = CAP 100nF 16V X7R 0402: Package: 0402; Voltage Rating: 16V; Supplier 1: Digi-Key; Supplier Part Number 1: 490-4759-1-ND
C32 = CAP 1uF 25V X5R 0402: Package: 0402; Voltage Rating: 25V; Supplier 1: Digi-Key; Supplier Part Number 1: 490-10017-1-ND
U8 = IC DAC DAC101C085: Supplier 1: Digi-Key; Supplier Part Number 1: DAC101C085CIMM/NOPBCT-ND

## Nets that join several sheets
+3V3: Main (R33.1 R34.2 R41.2), PGA (7 pins)
+5V: Main (R35.2), Input (C13.1 R21.1 R23.2 U3.2), Buffer (8 pins), PGA (15 pins)
+VUSB: Main (J2.27), Input (D2.1 K1.1)
-5V: Main (R38.2), Buffer (C11.1 C12.1 R19.2 U1.4)
GND: Main (42 pins), Input (16 pins), Buffer (16 pins), PGA (14 pins)
0dB_EN: Main (J2.23), Input (R30.2 R32.2)
DC_CPL_EN: Main (J2.21), Input (U4.1)
NetC1_2: Input (D1.1 R27.1), Buffer (C1.2 R1.1)
NetC14_2: Main (J1.1), Input (C14.2 C15.2 GDT1.1 U4.3)
NetQ1_2: Buffer (Q1.2 Q2.3 R4.1 R8.1), PGA (U7.6)
OUT_N: Main (J2.8), PGA (U7.14)
OUT_P: Main (J2.7), PGA (U7.15)
PGA_CSn: Main (J2.18), PGA (R45.1 U7.9)
PGA_SCLK: Main (J2.16), PGA (U7.11)
PGA_SDIO: Main (J2.17), PGA (U7.10)
THERMn: Main (D3.1 J2.24 R34.1), Input (U3.1)
TRIMDAC_SCL: Main (J2.20), PGA (Q4.3 R47.1)
TRIMDAC_SDA: Main (J2.19), PGA (Q5.3 R48.1)
VCM: Main (J2.10), PGA (U7.13)